# EAGLE design untitled (EAGLE 9.0.1)
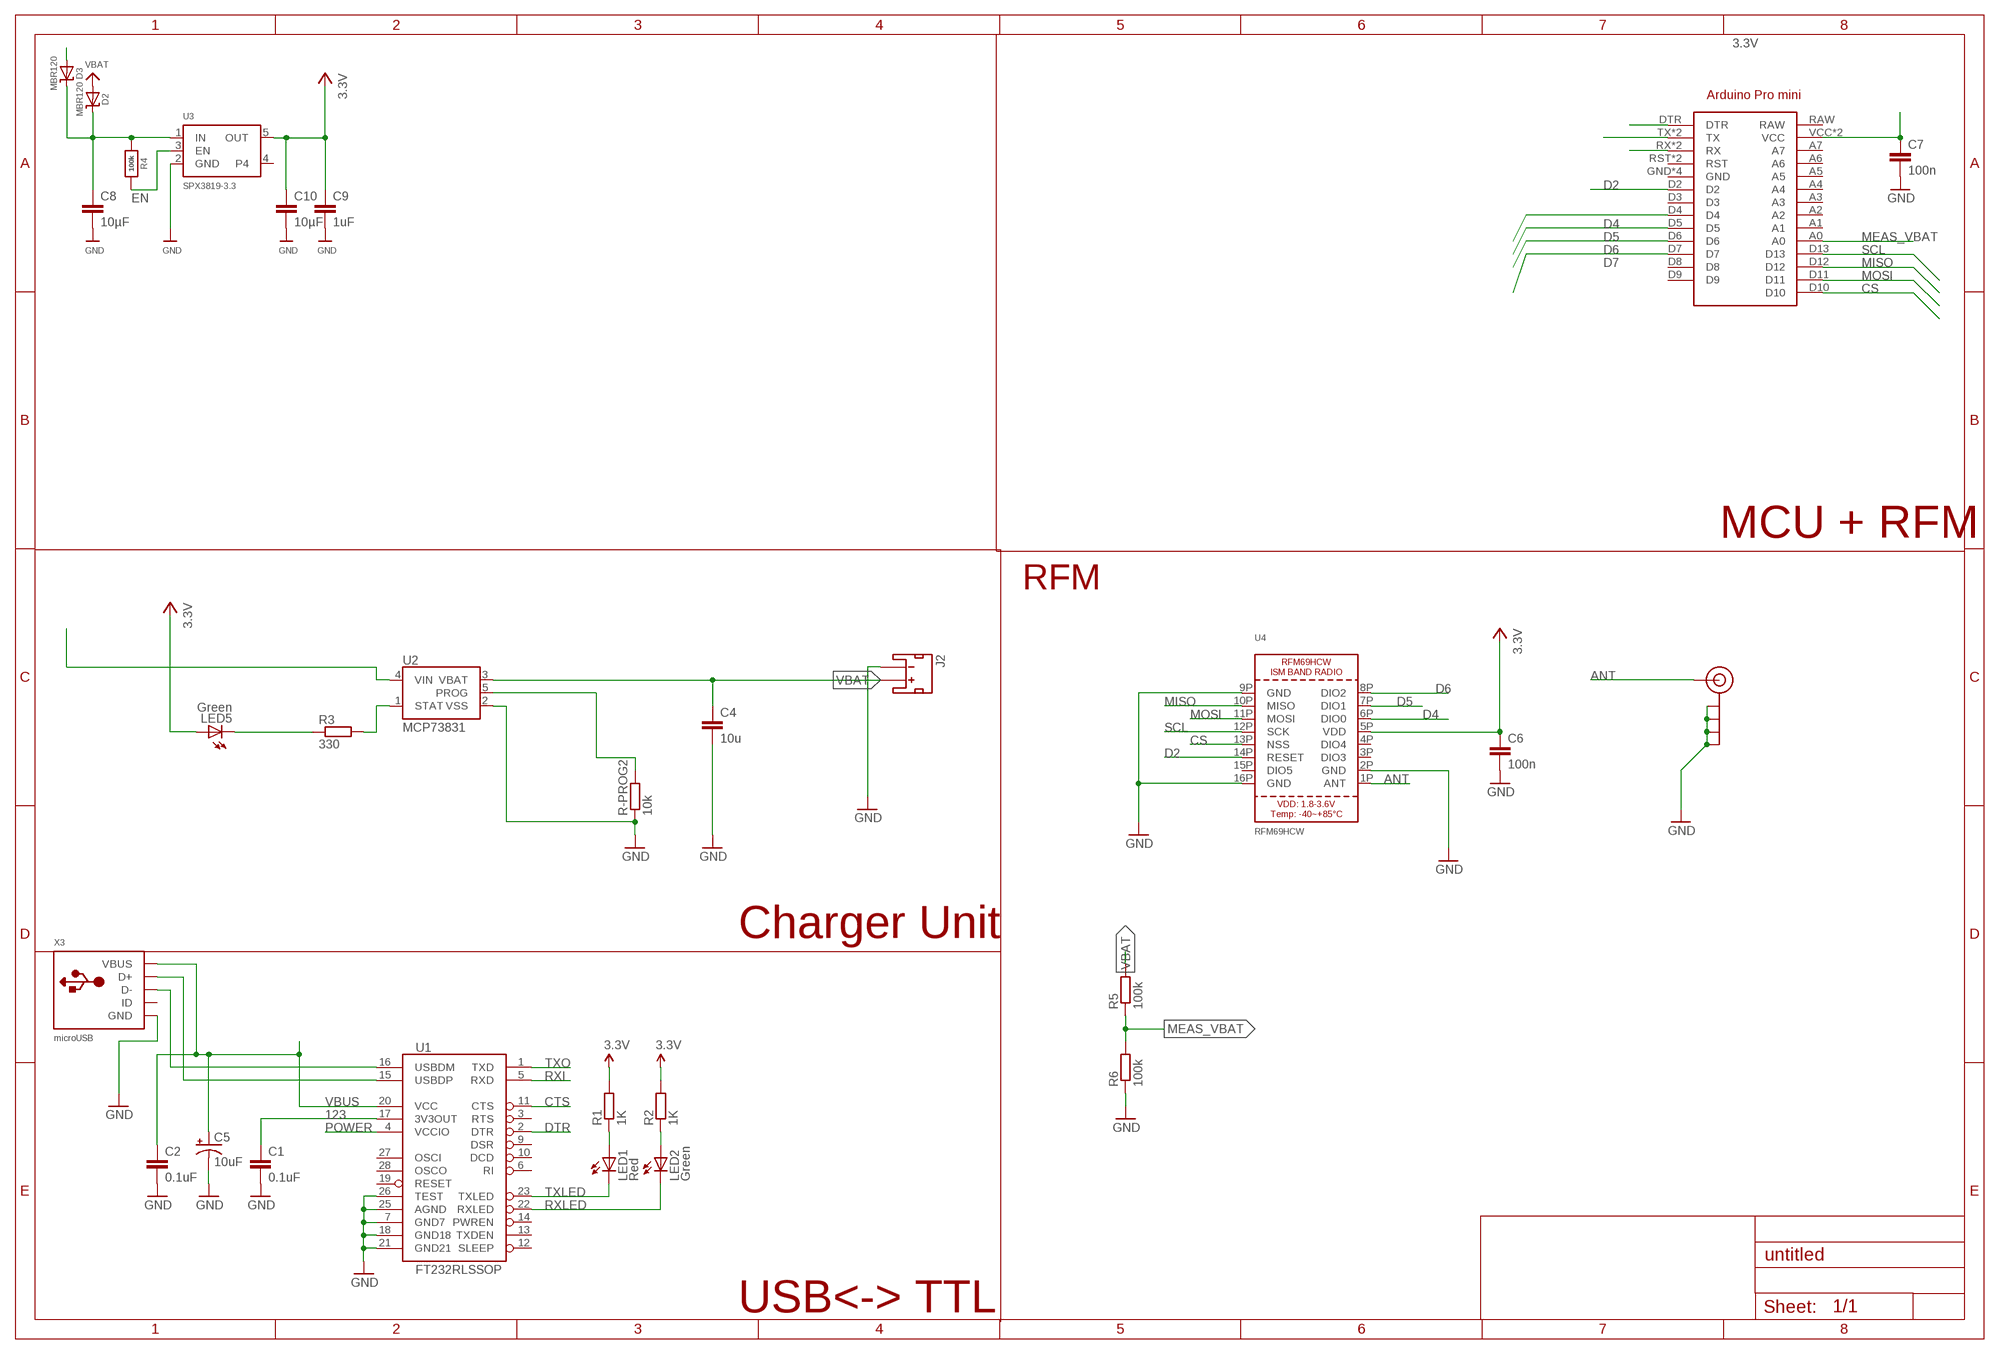
[diagram p0: schematic, sheet 1]

## Parts
C1  0.1uF  C-EUC0805  [C0805]
C2  0.1uF  C-EUC0805  [C0805]
C4  10u  C-EUC0805  [C0805]
C5  10uF  CAP_POL1206  [EIA3216]
C6  100n  C-EUC0805  [C0805]
C7  100n  C-EUC0805  [C0805]
C8  10µF  C-EUC0805  [C0805]
C9  1uF  C-EUC0805  [C0805]
C10  10µF  C-EUC0805  [C0805]
D2  MBR120  DIODE-SCHOTTKYSOD-123  [SOD-123]
D3  MBR120  DIODE-SCHOTTKYSOD-123  [SOD-123]
J2  JST_2MM_MALE  [JST-2-SMD]
J$2  ANTENNATINY  [SMA_UFL_PAD_TINY]
LED1  Red  LED0603  [LED-0603]
LED2  Green  LED0603  [LED-0603]
LED5  Green  LED0603  [LED-0603]
R1  1K  R-EU_R0805  [R0805]
R2  1K  R-EU_R0805  [R0805]
R3  330  R-EU_R0805  [R0805]
R4  100k  RESISTOR_0603_NOOUT  [0603-NO]
R5  100k  R-EU_R0805  [R0805]
R6  100k  R-EU_R0805  [R0805]
R-PROG2  10k  R-EU_R0805  [R0805]
U1  FT232RLSSOP  [SSOP28DB]
U2  MCP73831  [SOT23-5]
U3  SPX3819-3.3  VREG_SOT23-5  [SOT23-5]
U4  RFM69HCW  RFM69HCW_SMT  [RFMHCW_SMT]
U$1  ARDUINO_PRO_MINI  [ARDUINO_PRO_MINI]
X3  microUSB  USB_MICRO_20329_V2  [4UCONN_20329_V2]

## Nets
3.3V [power]: C6.1 C7.1 C9.1 C10.1 LED5.A R1.2 R2.2 U3.5(OUT) U4.5P(VDD) U$1.VCC U$1.VCC@1(VCC)
123 [power]: C1.1 U1.17(3V3OUT)
ANT: J$2.ANT1(SIGNAL) J$2.ANT2(SIGNAL) J$2.ANT3(SIGNAL) U4.1P(ANT)
CS: U4.13P(NSS) U$1.D10
CTS: U1.11(CTS)
D2: U4.14P(RESET) U$1.D2
D4: U4.6P(DIO0) U$1.D4
D5: U4.7P(DIO1) U$1.D5
D6: U4.8P(DIO2) U$1.D6
D7: U$1.D7
DTR: U1.2(DTR) U$1.DTR
EN: R4.2 U3.3(EN)
GND: C1.2 C2.2 C4.2 C5.C(-) C6.2 C7.2 C8.2 C9.2 C10.2 J2.1(-) J$2.GND1(GND) J$2.GND2(GND) J$2.GND3(GND) J$2.GND4(GND) R6.1 R-PROG2.1 U1.7(GND7) U1.18(GND18) U1.21(GND21) U1.25(AGND) U1.26(TEST) U2.2(VSS) U3.2(GND) U4.2P(GND) U4.9P(GND) U4.16P(GND) X3.BASE@1(GND) X3.BASE@2(GND) X3.GND X3.SPRT@1(GND) X3.SPRT@2(GND) X3.SPRT@3(GND) X3.SPRT@4(GND)
LOL: R-PROG2.2 U2.5(PROG)
MEAS_VBAT: R5.1 R6.2 U$1.A0
MISO: U4.10P(MISO) U$1.D12
MOSI: U4.11P(MOSI) U$1.D11
N$1: LED1.A R1.1
N$2: LED2.A R2.1
N$5: LED5.C R3.1
N$6: R3.2 U2.1(STAT)
POWER: U1.4(VCCIO)
RXI: U1.5(RXD) U$1.TX U$1.TX@1(TX)
RXLED: LED2.C U1.22(RXLED)
SCL: U4.12P(SCK) U$1.D13
TXLED: LED1.C U1.23(TXLED)
TXO: U1.1(TXD) U$1.RX U$1.RX@1(RX)
USB_D+: U1.15(USBDP) X3.D+
USB_D-: U1.16(USBDM) X3.D-
V5: C8.1 D2.C D3.C R4.1 U2.4(VIN) U3.1(IN)
VBAT: C4.1 D2.A J2.2(+) R5.2 U2.3(VBAT)
VBUS: C2.1 C5.A(+) D3.A U1.20(VCC) X3.VBUS
Unconnected: J2.NC1(PAD1) J2.NC2(PAD2) U1.3(RTS) U1.6(RI) U1.9(DSR) U1.10(DCD) U1.12(SLEEP) U1.13(TXDEN) U1.14(PWREN) U1.19(RESET) U1.27(OSCI) U1.28(OSCO) U3.4 U4.3P(DIO3) U4.4P(DIO4) U4.15P(DIO5) U$1.A1 U$1.A2 U$1.A3 U$1.A4 U$1.A5 U$1.A6 U$1.A7 U$1.D3 U$1.D8 U$1.D9 U$1.RAW U$1.RST U$1.RST@1(RST) X3.ID

## Notes on the sheet
- MCU + RFM
- RFM
- Charger Unit
- USB<-> TTL

## Power pins joined to a net without a drawn wire
GND: U$1.GND U$1.GND@1(GND) U$1.GND@2(GND) U$1.GND@3(GND)

## Library data of the parts
C1 C2 C4 C6-C10 = rcl:C-EU: CAPACITOR, European symbol
C5 = SparkFun:CAP_POL: Capacitor Polarized These are standard SMD and PTH capacitors. Normally 10uF, 47uF, and 100uF in electrolytic and tantalum varieties. Always verify the external diameter of the through hole cap, it varies with capacity, voltage, and manufacturer. The EIA devices should be standard.
D2 D3 = microbuilder:DIODE-SCHOTTKY
J2 = SparkFun-Connectors:JST_2MM_MALE: Mates to single-cell LiPo batteries. CONN-08352; PROD_ID: CONN-08352
J$2 = _c2h:ANTENNA: SMA Antenna Connector End launch SMA connector. The paste layer has been removed so that the connector can be hand soldered onto the board after reflow.
LED1 LED2 LED5 = SparkFun:LED: LEDs Standard schematic elements and footprints for 5mm, 3mm, 1206, and 0603 sized LEDs. 5mm - Spark Fun Electronics SKU : COM-00529 (and others)
R1-R3 R5 R6 R-PROG2 = rcl:R-EU_: RESISTOR, European symbol; SPICEPREFIX: R
R4 = microbuilder:RESISTOR: Resistors For new designs, use the packages preceded by an '_' character since they are more reliable: The following footprints should be used on most boards: _0402 - Standard footprint for regular board layouts _0603 - Standard footprint for regular board layouts _0805 - Standard footprint for regular board layouts _1206 - Standard footprint for regular board layouts For extremely tight-pitch boards where space is at a premium, the following 'micro-pitch' footprints can be used (smaller pads, no silkscreen outline, etc.): _0402MP - Micro-pitch footprint for very dense/compact boards _0603MP - Micro-pitch footprint for very dense/compact boards _0805MP - Micro-pitch footprint for very dense/compact boards _1206MP - Micro-pitch footprint for very dense/compact boards
U1 = SparkFun:FT232RL: USB UART FT232RL 4th Generation USB UART (USB <-> Serial) Controller. Spark Fun Electronics SKU : COM-00650
U2 = SparkFun-PowerIC:MCP73831: Miniature single cell, fully integrated Li-Ion, Li-polymer charge management controller http://ww1.microchip.com/downloads/en/DeviceDoc/21984a.pdf IC-09995; PROD_ID: IC-09995
U3 = microbuilder:VREG_SOT23-5: SOT23-5 Fixed Voltage Regulators Part Current Out V Out V In V Dropout θJA (°C/W) TJ (°C) Digikey Part No. ADP121 150mA 3.3V 3.4-5.5V 0.09V @ 150mA -- -- ADP121-AUJZ33R7CT-ND ADP121 150mA 3.0V 3.1-5.5V 0.09V @ 150mA -- -- ADP121-AUJZ30R7CT-ND ADP122 300mA 3.3V 3.4-5.5V 0.085V @ 300mA -- -- ADP122AUJZ-3.3-R7CT-ND ADP1712 300mA 3.3V 3.5-5.5V 0.17V @ 300mA -- -- ADP1712AUJZ-3.3-R7TR-ND AP7311 (Low Cost) 150mA 3.3V 3.5-6V 0.15V @ 150mA -- -- AP7311-33WG-7DICT-ND LD39015M18R 150mA 1.8V 1.9V-5.5V 0.08V @ 100mA -- -- 497-6977-1-ND LP2985A-33DBVR 150mA 3.3V 3.3-16V 0.28V @ 150mA 206 150 296-18479-1-ND MCP1824T-3302E/OT 300mA 3.3V 3.5V-6V 0.2V @ 300mA -- -- MCP1824T-3302E/OTCT-ND MIC5205-2.5YM5 TR 150mA 2.5V 2.7-16V 0.165V @ 150mA -- -- 576-1257-2-ND MIC5205-3.0YM5 TR 150mA 3.0V 3.2V-16V 0.165V @ 150mA -- -- 576-1258-2-ND MIC5205-3.3YM5 TR 150mA 3.3V 3.5V-16V 0.165V @ 150mA -- -- 576-1259-2-ND TPS780330220 150mA 3.3V+2.2V 3.6-5.5V 250mV Max -- -- 296-23332-1-ND TDA3663/N1,135 100mA 3.3V 3.5-45V 0.18V @ 50mA -- -- 568-5343-1-ND Max operating temp can be calculated using θJA, TJ (max junction temperature), and power in watts. Set the "Maximum Ambient Temperature" until it reaches TJ ("Max Junction Temperature"), which is the absolute limit for safe use of the regulator: Heat Sink Temperature Calculator <http://www.daycounter.com/Calculators/Heat-Sink-Temperature-Calculator.phtml> For example, With 12V source into a 3.3V LP2985 and a 30mA load, we are dissipating (12V-3.3V) * 0.03A = 0.261W. With a θJA of 206 °C/W, a TJ of 150°C, and 261mW we can safely use the chip without a heat sink up to 75°C (=147.1°C Junction Temperature).
U4 = microbuilder:RFM69HCW: RFM69HCW - ISM Band RF Transceiver
U$1 = arduinopromini:ARDUINO_PRO_MINI: For creating Arduino Pro Mini shields
X3 = microbuilder:USB: USB Connectors USBMINIB - Surface Mount Female Mini-B USB Connector 4UConnector: 06564

## Net classes
0 default: width 0.254 mm, drill 0.6 mm, clearance 0.254 mm
1 power: width 0.406 mm, drill 0.6 mm, clearance 0.205 mm to class 0, clearance 0.254 mm

## Board
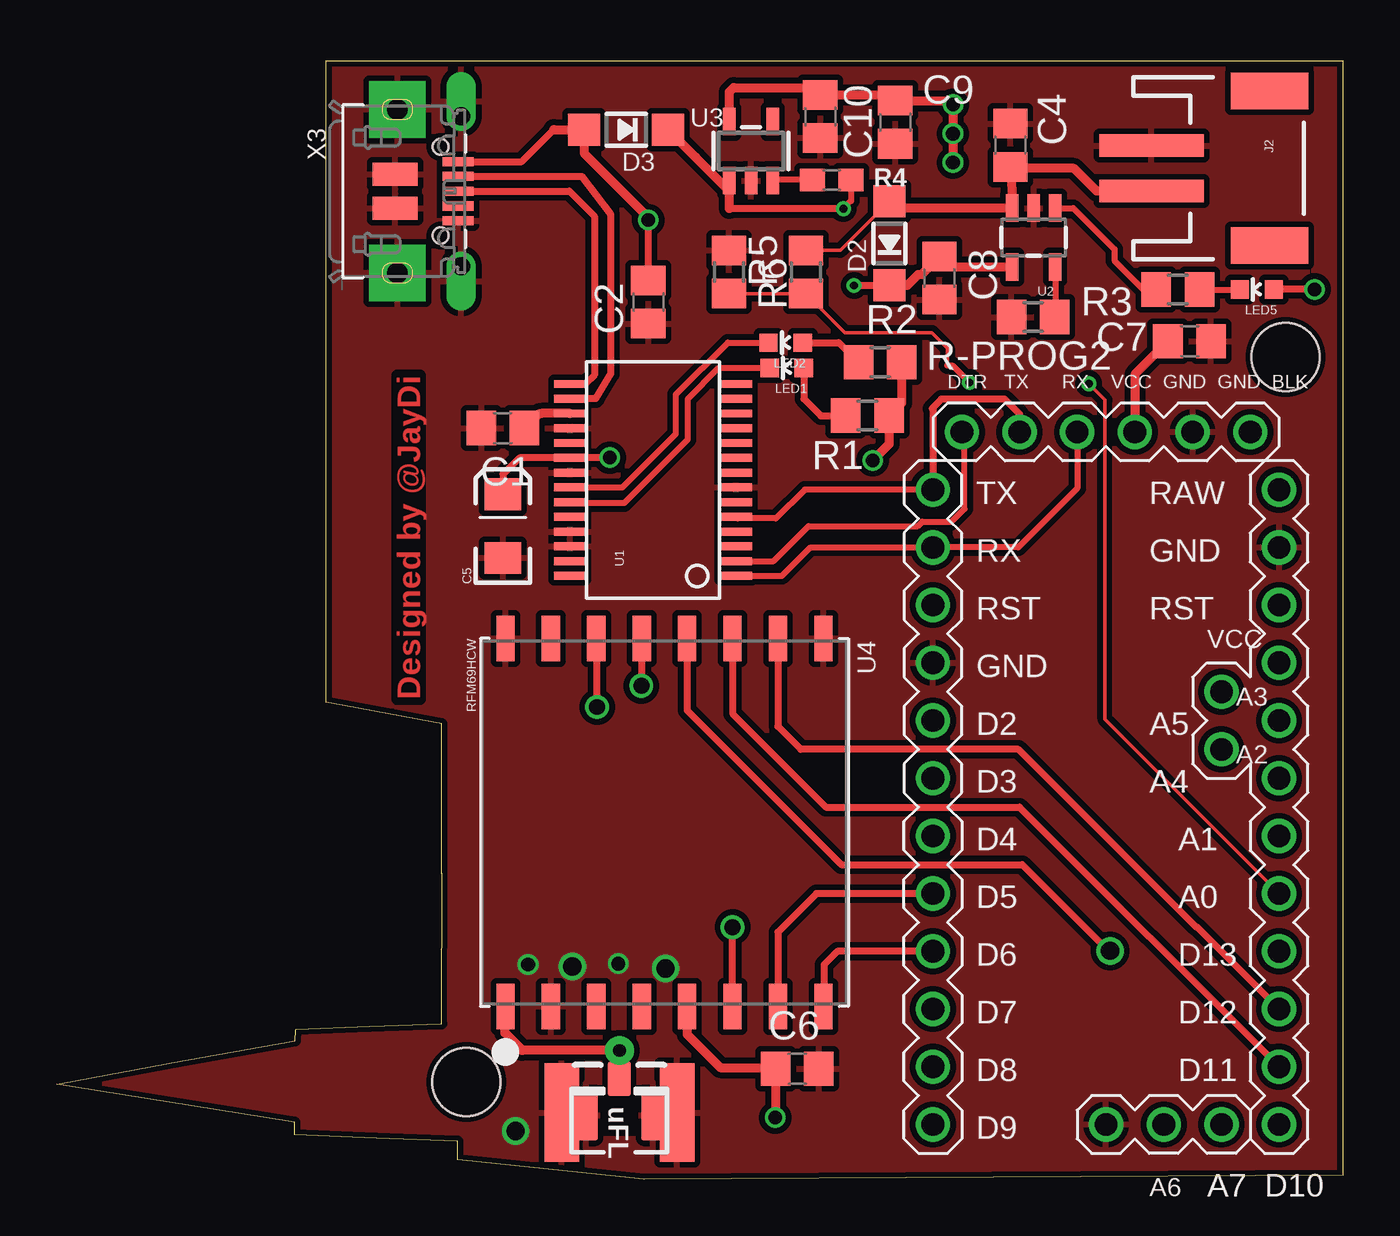
[diagram p1: board, top side]
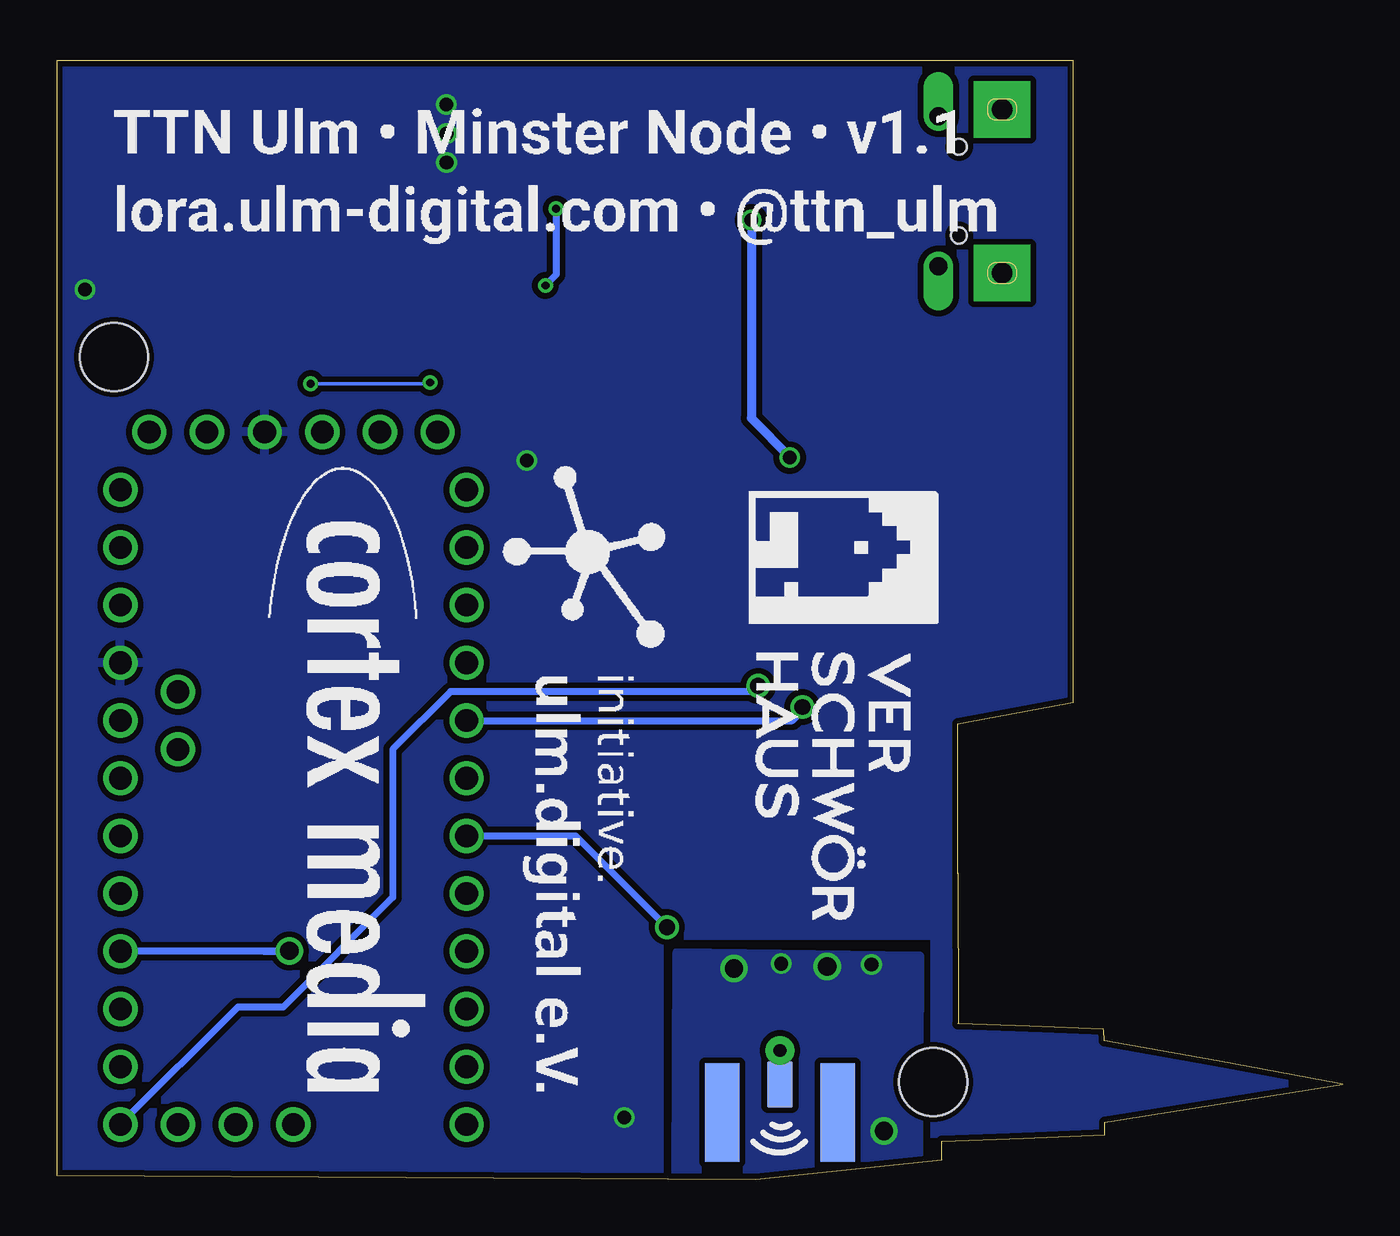
[diagram p2: board, bottom side, seen from below]

Size 56.62 x 49.21 mm. Coordinates in mm from the lower left corner, seen from the top.
Outline: 16.93,13.44 16.93,20.04 11.85,20.99 11.85,49.21 56.62,49.21 56.62,0.18 41.24,0.09 25.86,0 17.64,0.86 17.64,1.66 14.06,1.8 10.48,1.94 10.48,2.5 0,4.16 5.29,5.17 10.5,6.09 10.52,6.55 10.53,6.6 13.78,6.72 16.93,6.84
Outline: 16.93,13.45 16.93,6.84
Copper layers (1*16): Top 0.035mm / dielectric 1.5mm / Bottom 0.035mm
Design rules "dirt_cheap_dirty_boards.v1": minimum track width 5mil, minimum drill 12mil, track to track 5mil, track to pad 5mil, pad to pad 5mil, via to via 5mil, smd to smd 0mil, copper to edge 10mil, drill to drill 10mil, minimum pad ring 10mil, minimum via ring 6mil, stop-mask expansion 2mil, vias tented up to drill 25mil, thermal gap 10mil
Holes 3 mm at 18.03,4.27 54.1,36.18

### Footprints (pad centres in the part's own frame; a part is rotated, then mirrored left to right if it is on the bottom)
C0805 = smd 1.3 x 1.5: 1 -0.95,0; 2 0.95,0
EIA3216 = smd 1.4 x 1.6: A 1.4,0; C -1.4,0
SOD-123 = smd 1.4 x 1.4: A 1.85,0; C -1.85,0
JST-2-SMD = smd 1 x 4.6: 1 -1,-3.7; 2 1,-3.7 | smd 1.6 x 3.4: NC1 -3.4,1.5; NC2 3.4,1.5
SMA_UFL_PAD_TINY = smd 1.524 x 1.016: ANT1 -3.843,0 | drill 0.559 pad 1.27: ANT2 -5.08,0 | smd 2.032 x 1.143 bottom: ANT3 -3.589,0 | smd 2.2 x 1.016: GND1 -2.223,1.47; GND2 -2.223,-1.47 | smd 4.318 x 1.524: GND3 -2.349,-2.54; GND4 -2.349,2.54 | smd 4.318 x 1.524 bottom: GND5 -2.349,2.54; GND6 -2.349,-2.54
LED-0603 = smd 0.8 x 0.8: A 0,-0.75; C 0,0.75
R0805 = smd 1.3 x 1.5: 1 -0.95,0; 2 0.95,0
0603-NO = smd 1.1 x 1: 1 -0.85,0; 2 0.85,0
SSOP28DB = smd 0.348 x 1.397: 1 -4.225,-3.656; 2 -3.575,-3.656; 3 -2.925,-3.656; 4 -2.275,-3.656; 5 -1.625,-3.656; 6 -0.975,-3.656; 7 -0.325,-3.656; 8 0.325,-3.656; 9 0.975,-3.656; 10 1.625,-3.656; 11 2.275,-3.656; 12 2.925,-3.656; 13 3.575,-3.656; 14 4.225,-3.656; 15 4.225,3.656; 16 3.575,3.656; 17 2.925,3.656; 18 2.275,3.656; 19 1.625,3.656; 20 0.975,3.656; 21 0.325,3.656; 22 -0.325,3.656; 23 -0.975,3.656; 24 -1.625,3.656; 25 -2.275,3.656; 26 -2.925,3.656; 27 -3.575,3.656; 28 -4.225,3.656
SOT23-5 = smd 0.55 x 1.2: 1 -0.95,-1.3; 2 0,-1.3; 3 0.95,-1.3; 4 0.95,1.3; 5 -0.95,1.3
RFMHCW_SMT = smd 2 x 0.8: 1P 8.1,-7; 2P 8.1,-5; 3P 8.1,-3; 4P 8.1,-1; 5P 8.1,1; 6P 8.1,3; 7P 8.1,5; 8P 8.1,7; 9P -8.1,7; 10P -8.1,5; 11P -8.1,3; 12P -8.1,1; 13P -8.1,-1; 14P -8.1,-3; 15P -8.1,-5; 16P -8.1,-7
ARDUINO_PRO_MINI = drill 1: A0 11.43,-8.89; A1 11.43,-6.35; A2 11.43,-3.81; A3 11.43,-1.27; A4 8.89,-2.54; A5 8.89,0; A6 6.35,-19.05; A7 8.89,-19.05; BLK 10.16,11.43; D2 -3.81,-1.27; D3 -3.81,-3.81; D4 -3.81,-6.35; D5 -3.81,-8.89; D6 -3.81,-11.43; D7 -3.81,-13.97; D8 -3.81,-16.51; D9 -3.81,-19.05; D10 11.43,-19.05; D11 11.43,-16.51; D12 11.43,-13.97; D13 11.43,-11.43; DTR -2.54,11.43; GND -3.81,1.27; GND@1 11.43,6.35; GND@2 7.62,11.43; GND@3 3.81,-19.05; RAW 11.43,8.89; RST 11.43,3.81; RST@1 -3.81,3.81; RX -3.81,6.35; RX@1 2.54,11.43; TX -3.81,8.89; TX@1 0,11.43; VCC 11.43,1.27; VCC@1 5.08,11.43
4UCONN_20329_V2 = smd 1 x 2: BASE@1 -0.75,-2; BASE@2 0.75,-2 | smd 0.4 x 1.35: D+ 0,0.775; D- -0.65,0.775; GND 1.3,0.775; ID 0.65,0.775; VBUS -1.3,0.775 | drill 0.8 pad 1.2 offset: SPRT@1 -3.3,0.9; SPRT@2 3.3,0.9 | drill 0.9 pad 2.5 square: SPRT@3 -3.6,-1.9; SPRT@4 3.6,-1.9 | hole 0.7: -1.95,0; 1.95,0

### Placement (x,y rotation side)
C1  19.65,33.06 180 top
C2  26.04,38.6 270 top
C4  42,45.5 90 top
C5  19.65,28.74 90 top
C6  32.6,4.86 0 top
C7  49.87,36.87 0 top
C8  38.87,39.66 270 top
C9  36.92,46.52 270 top
C10  33.62,46.77 270 top
D2  36.66,41.18 90 top
D3  25.07,46.19 180 top
J2  51.9,44.49 270 top
J$2  24.78,0.58 270 top
LED1  32.14,35.7 90 top
LED2  32.09,36.81 90 top
LED5  52.83,39.15 90 top
R1  35.69,33.61 0 top
R2  36.25,35.95 0 top
R3  49.36,39.15 180 top
R4  34.12,43.98 180 top
R5  32.99,39.92 90 top
R6  29.6,39.92 270 top
R-PROG2  42.99,37.94 0 top
U1  26.25,30.77 90 top
U2  43.01,41.44 180 top
U3  30.57,45.25 0 top
U4  26.75,15.7 270 top
U$1  42.39,21.45 0 top
X3  16.9,43.48 270 top

### Tracks (layer width: path | path; a pad name or v marks a point on that pad's centre or on a via)
3.3V  (via drill 0.6, 0.6 pad 0.85)
  Top 0.305: v55.39,39.16 53.59,39.16 LED5.A
  Top 0.406: U3.5 29.62,47.85 29.81,48.04 33.55,48.04 C10.1 36.66,47.72 C9.1 39.29,47.47 v39.47,47.29 39.47,46.02 v39.46,46.01 v39.46,44.74 | 48.67,36.61 C7.1 47.47,35.41 U$1.VCC@1 | R2.2 37.2,34.17 R1.2 36.64,32.35 v35.93,31.63 35.9,31.61 | U4.5P 27.75,6.37 29.22,4.91 31.61,4.91 C6.1 31.65,2.93 31.63,2.91 v31.63,2.7
  pour Bottom: 29.98,-0.3 56.78,-0.3 56.78,50.42 -0.93,50.42 -0.93,0.12 17.96,0.08 17.96,10.71 30.11,10.71 30.11,-0.26
123
  Top 0.406: U1.17 21.34,33.69 arc45 21.16,33.62 C1.1
ANT
  Top 0.406: J$2.ANT1 J$2.ANT2 20.51,5.66 19.73,6.43 19.73,7.58 U4.1P
  Bottom 0.406: J$2.ANT2 J$2.ANT3
CS  (via drill 0.7 pad 1.05)
  Top 0.305: U4.13P 25.74,23.8 v25.74,21.71
  Bottom 0.305: v25.74,21.71 25.99,21.45 39.28,21.45 41.82,18.91 41.82,12.4 46.65,7.57 48.65,7.57 U$1.D10
D2  (via drill 0.7 pad 1.05)
  Top 0.305: v23.79,20.78 23.79,23.76 U4.14P
  Bottom 0.305: U$1.D2 24.22,20.18 23.79,20.61 v23.79,20.78
D4  (via drill 0.7 pad 1.05)
  Top 0.305: U4.6P v29.75,11.09 29.75,11.17
  Bottom 0.305: U$1.D4 33.77,15.1 v29.75,11.09
D5
  Top 0.305: U$1.D5 33.44,12.56 31.75,10.87 U4.7P
D6
  Top 0.305: U$1.D6 34.37,10.02 33.78,9.43 33.78,7.23 33.95,7.06 33.95,7.4 U4.8P
DTR
  Top 0.254: U1.2 31.56,27.19 33.11,28.74 37.91,28.74 38.11,28.94 39.4,28.94 39.97,29.5 39.97,32.77 U$1.DTR
EN
  Top 0.254: R4.2 31.55,43.98 U3.3
GND  (via drill 0.6, 0.8)
  Top 0.406: J$2.GND2 22.87,3.05 J$2.GND3
  other vias: 22.7,9.35 26.8,9.27 20.2,2.11 20.75,9.44 24.73,9.48
  pour Top: 11.77,49.24 11.54,7.38 -0.78,6.23 0.37,-0.09 44.66,-0.37 57.34,-0.22 57.06,49.95 11.69,49.46
  pour Bottom: 29.3,9.99 18.63,9.82 18.68,-0.22 29.35,0.04
LOL
  Top 0.254: U2.5 43.96,38.41 R-PROG2.2
MEAS_VBAT  (via drill 0.35)
  Top 0.152: R6.2 R5.1 | R5.1 | U$1.A0 46.16,20.23 46.16,34.29 v45.44,35.01 | 39.21,35.81 39.21,36.58 38.53,37.25 34.7,37.25 R5.1
  Top 0.254: 39.21,35.81 39.43,35.81 v40.19,35.06
  Bottom 0.152: v45.44,35.01 40.23,35.01 v40.19,35.06
MISO
  Top 0.305: 31.75,19.92 32.77,18.91 42.34,18.91 50.16,11.1 50.21,11.1 U$1.D12 | 31.75,19.92 31.75,19.93 | U4.10P 31.75,19.92
MOSI
  Top 0.305: U4.11P 29.75,20.49 33.87,16.37 42.39,16.37 U$1.D11
N$1
  Top 0.305: LED1.A 32.89,34.34 33.64,33.59 34.72,33.59 R1.1
N$2
  Top 0.305: LED2.A 34.43,36.81 R2.1
N$5
  Top 0.254: R3.1 LED5.C
N$6
  Top 0.254: U2.1 44.76,42.74 46.57,40.93 46.57,40.42 47.84,39.15 R3.2
RXI
  Top 0.254: U1.5 29.98,29.07 31.66,29.07 32.93,30.34 U$1.TX
  Top 0.305: U$1.TX@1 42.39,33.68 41.74,34.33 38.95,34.33 38.54,33.91 38.58,33.87 U$1.TX
RXLED
  Top 0.254: U1.22 24.91,30.44 27.27,32.8 27.27,34.54 29.54,36.81 LED2.C
SCL  (via drill 0.8)
  Top 0.305: U4.12P 27.75,20.62 34.54,13.83 42.51,13.83 46.31,10.04 v46.38,10.04 46.4,10.03
  Bottom 0.305: 46.4,10.03 47.51,10.03 | 47.51,10.03 U$1.D13 | 47.51,10.03 46.4,10.03 | 46.4,10.03 v46.38,10.04
TXLED
  Top 0.254: U1.23 22.63,29.75 24.98,29.75 27.77,32.55 27.77,34.33 29.15,35.7 LED1.C
TXO
  Top 0.254: U1.1 31.93,26.54 33.19,27.8 U$1.RX 42.33,27.8 44.93,30.4 U$1.RX@1
USB_D+
  Top 0.305: U1.15 23.29,34.99 23.67,35.38 23.67,42.38 | 23.67,42.38 22.6,43.45 | X3.D+ 22.57,43.48 23.67,42.38
USB_D-
  Top 0.254: U1.16 22.57,34.33
  Top 0.305: U1.16 arc-45 22.61,34.35 23.72,34.35 24.39,35.44 24.39,42.46 23.11,44.13 X3.D-
V5  (via drill 0.35)
  Top 0.254: R4.1 34.97,43.05 v34.63,42.71
  Top 0.305: D2.C 35.9,39.33 v35.1,39.33 | v34.63,42.71 29.62,42.71
  Top 0.406: 29.59,43.98 U3.1 29.62,43.48 | 29.62,42.71 29.62,43.48 | C8.1 | C8.1 38.09,39.82 37.93,39.82 37.45,39.33 D2.C | 29.62,43.48 28.13,44.97 28.13,44.98 D3.C | U2.4 39.33,40.14 C8.1
  Bottom 0.305: v34.63,42.71 34.63,39.8 v35.1,39.33
VBAT
  Top 0.152: D2.A 34.5,40.87 R5.2
  Top 0.406: 42.02,44.3 42.06,43.45 U2.3 36.96,42.74 D2.A | 42.02,44.3 C4.1 | J2.2 45.79,43.49 44.79,44.49 42.2,44.49 42.02,44.3
VBUS  (via drill 0.6)
  Top 0.254: C5.A 19.73,30.22
  Top 0.305: C5.A 19.65,31.02 20.37,31.74 U1.20 v24.35,31.75 | X3.VBUS 20.47,44.78 21.88,46.19 | v26.04,42.21 C2.1
  Top 0.406: 21.88,46.19 D3.A 23.22,45.16 26.13,42.25 26.09,42.25 v26.04,42.21
  Bottom 0.406: v26.04,42.21 26.04,33.49 24.31,31.75 v24.35,31.75

### Text on the board
Top: Designed by @JayDi